# EAGLE design motherboard_v1_21 (EAGLE 7.5.0)
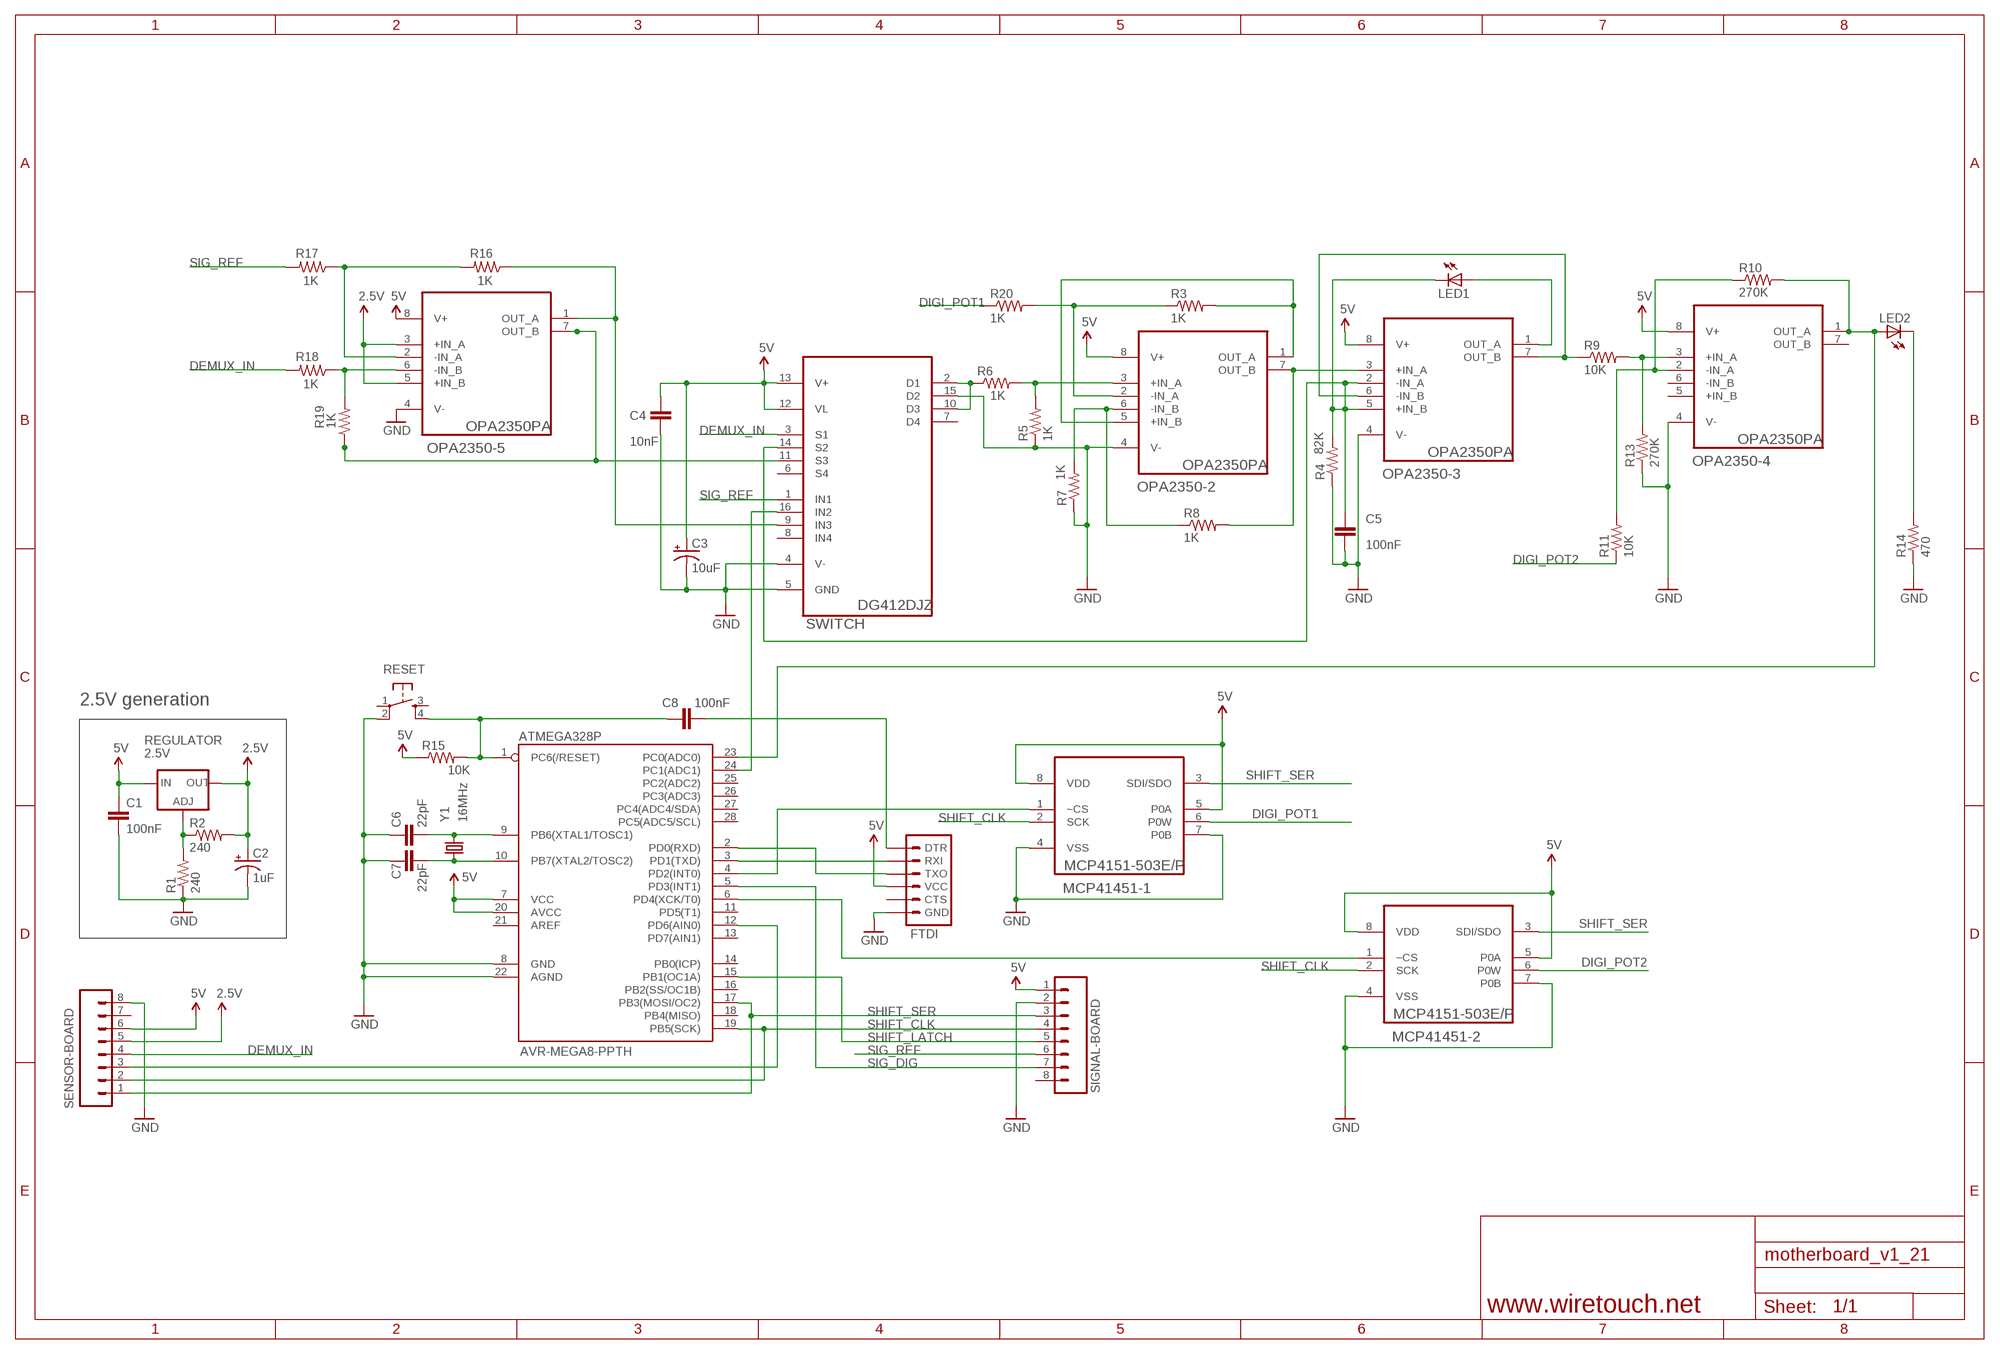
[diagram p0: schematic, sheet 1]

## Parts
ATMEGA328P  AVR-MEGA8-PPTH  [DIL28-3]
C1  100nF  CAPPTH  [CAP-PTH-SMALL]
C2  1uF  CAP_POLPTH2  [CPOL-RADIAL-10UF-25V]
C3  10uF  CAP_POLPTH2  [CPOL-RADIAL-10UF-25V]
C4  10nF  CAPPTH  [CAP-PTH-SMALL]
C5  100nF  CAPPTH  [CAP-PTH-SMALL]
C6  22pF  CAPPTH2  [CAP-PTH-SMALL2]
C7  22pF  CAPPTH2  [CAP-PTH-SMALL2]
C8  100nF  CAPPTH2  [CAP-PTH-SMALL2]
FTDI  ARDUINO_SERIAL_PROGRAMLONGPADS  [1X06_LONGPADS]
LED1  LED3MM  [LED3MM]
LED2  LED5MM  [LED5MM]
MCP41451-1  MCP4151-503E/P  [DIP254P762X533-8]
MCP41451-2  MCP4151-503E/P  [DIP254P762X533-8]
OPA2350-2  OPA2350PA  [DIP254P762X508-8]
OPA2350-3  OPA2350PA  [DIP254P762X508-8]
OPA2350-4  OPA2350PA  [DIP254P762X508-8]
OPA2350-5  OPA2350PA  [DIP254P762X508-8]
R1  240  RESISTORAXIAL-0.3  [AXIAL-0.3]
R2  240  RESISTORAXIAL-0.3  [AXIAL-0.3]
R3  1K  RESISTORAXIAL-0.3  [AXIAL-0.3]
R4  82K  RESISTORAXIAL-0.3  [AXIAL-0.3]
R5  1K  RESISTORAXIAL-0.3  [AXIAL-0.3]
R6  1K  RESISTORAXIAL-0.3  [AXIAL-0.3]
R7  1K  RESISTORAXIAL-0.3  [AXIAL-0.3]
R8  1K  RESISTORAXIAL-0.3  [AXIAL-0.3]
R9  10K  RESISTORAXIAL-0.3  [AXIAL-0.3]
R10  270K  RESISTORAXIAL-0.3  [AXIAL-0.3]
R11  10K  RESISTORAXIAL-0.3  [AXIAL-0.3]
R13  270K  RESISTORAXIAL-0.3  [AXIAL-0.3]
R14  470  RESISTORAXIAL-0.3  [AXIAL-0.3]
R15  10K  RESISTORAXIAL-0.3  [AXIAL-0.3]
R16  1K  RESISTORAXIAL-0.3  [AXIAL-0.3]
R17  1K  RESISTORAXIAL-0.3  [AXIAL-0.3]
R18  1K  RESISTORAXIAL-0.3  [AXIAL-0.3]
R19  1K  RESISTORAXIAL-0.3  [AXIAL-0.3]
R20  1K  RESISTORAXIAL-0.3  [AXIAL-0.3]
REGULATOR  2.5V  V_REG_317SINK  [TO220-ADJ]
RESET  TAC_SWITCHPTH  [TACTILE-PTH]
SENSOR-BOARD  M08LONGPADS  [1X08_LONGPADS]
SIGNAL-BOARD  M08LONGPADS  [1X08_LONGPADS]
SWITCH  DG412DJZ  [DIP254P762X533-16]
Y1  16MHz  CRYSTALHC49US  [HC49US]

## Nets
2.8V: C2.1(+) OPA2350-5.3(+IN_A) OPA2350-5.5(+IN_B) R2.P$2 REGULATOR.OUT SENSOR-BOARD.5 ; supply symbol labelled 2.5V
5V: ATMEGA328P.7(VCC) ATMEGA328P.20(AVCC) C1.1 C3.1(+) C4.1 FTDI.4(VCC) MCP41451-1.5(P0A) MCP41451-1.8(VDD) MCP41451-2.5(P0A) MCP41451-2.8(VDD) OPA2350-2.8(V+) OPA2350-3.8(V+) OPA2350-4.8(V+) OPA2350-5.8(V+) R15.P$1 REGULATOR.IN SENSOR-BOARD.6 SIGNAL-BOARD.1 SWITCH.12(VL) SWITCH.13(V+)
DEMUX_IN: R18.P$2 SENSOR-BOARD.4 SWITCH.3(S1)
DIGI_POT1: MCP41451-1.6(P0W) R20.P$1
DIGI_POT2: MCP41451-2.6(P0W) R11.P$1
GND: ATMEGA328P.8(GND) ATMEGA328P.22(AGND) C1.2 C2.2(-) C3.2(-) C4.2 C5.2 C6.1 C7.1 FTDI.6(GND) MCP41451-1.4(VSS) MCP41451-1.7(P0B) MCP41451-2.4(VSS) MCP41451-2.7(P0B) OPA2350-2.4(V-) OPA2350-3.4(V-) OPA2350-4.4(V-) OPA2350-5.4(V-) R1.P$1 R4.P$1 R5.P$1 R7.P$1 R13.P$1 R14.P$1 RESET.2 SENSOR-BOARD.8 SIGNAL-BOARD.2 SWITCH.4(V-) SWITCH.5(GND) SWITCH.15(D2)
N$1: R6.P$1 SWITCH.2(D1) SWITCH.10(D3)
N$2: OPA2350-2.1(OUT_A) OPA2350-2.5(+IN_B) R3.P$2
N$3: R1.P$2 R2.P$1 REGULATOR.ADJ
N$4: OPA2350-2.2(-IN_A) R3.P$1 R20.P$2
N$5: OPA2350-2.3(+IN_A) R5.P$2 R6.P$2
N$6: OPA2350-2.6(-IN_B) R7.P$2 R8.P$1
N$7: OPA2350-4.2(-IN_A) R10.P$1 R11.P$2
N$8: ATMEGA328P.24(PC1(ADC1)) SWITCH.16(IN2)
N$9: LED1.A OPA2350-3.1(OUT_A)
N$10: OPA2350-2.7(OUT_B) OPA2350-3.3(+IN_A) R8.P$2
N$11: C5.1 LED1.K(C) OPA2350-3.2(-IN_A) OPA2350-3.5(+IN_B) R4.P$2 SWITCH.14(S2)
N$12: OPA2350-3.6(-IN_B) OPA2350-3.7(OUT_B) R9.P$1
N$13: OPA2350-4.3(+IN_A) R9.P$2 R13.P$2
N$14: ATMEGA328P.23(PC0(ADC0)) LED2.A OPA2350-4.1(OUT_A) R10.P$2
N$15: ATMEGA328P.6(PD4(XCK/T0)) MCP41451-2.1(~CS)
N$16: OPA2350-5.6(-IN_B) R18.P$1 R19.P$2
N$17: LED2.K(C) R14.P$2
N$18: ATMEGA328P.9(PB6(XTAL1/TOSC1)) C6.2 Y1.2
N$19: ATMEGA328P.10(PB7(XTAL2/TOSC2)) C7.2 Y1.1
N$20: ATMEGA328P.1(PC6(/RESET)) C8.1 R15.P$2 RESET.4
N$21: ATMEGA328P.3(PD1(TXD)) FTDI.2(RXI)
N$22: ATMEGA328P.2(PD0(RXD)) FTDI.3(TXO)
N$23: C8.2 FTDI.1(DTR)
N$24: OPA2350-5.1(OUT_A) R16.P$1 SWITCH.9(IN3)
N$25: OPA2350-5.2(-IN_A) R16.P$2 R17.P$1
N$27: OPA2350-5.7(OUT_B) R19.P$1 SWITCH.11(S3)
N$28: ATMEGA328P.4(PD2(INT0)) MCP41451-1.1(~CS)
N$127: ATMEGA328P.12(PD6(AIN0)) SENSOR-BOARD.3
SHIFT_CLK: ATMEGA328P.19(PB5(SCK)) MCP41451-1.2(SCK) MCP41451-2.2(SCK) SENSOR-BOARD.2 SIGNAL-BOARD.4
SHIFT_LATCH: ATMEGA328P.15(PB1(OC1A)) SIGNAL-BOARD.5
SHIFT_SER: ATMEGA328P.17(PB3(MOSI/OC2)) MCP41451-1.3(SDI/SDO) MCP41451-2.3(SDI/SDO) SENSOR-BOARD.1 SIGNAL-BOARD.3
SIG_DIG: ATMEGA328P.5(PD3(INT1)) SIGNAL-BOARD.7
SIG_REF: R17.P$2 SIGNAL-BOARD.6 SWITCH.1(IN1)
Unconnected: ATMEGA328P.11(PD5(T1)) ATMEGA328P.13(PD7(AIN1)) ATMEGA328P.14(PB0(ICP)) ATMEGA328P.16(PB2(SS/OC1B)) ATMEGA328P.18(PB4(MISO)) ATMEGA328P.21(AREF) ATMEGA328P.25(PC2(ADC2)) ATMEGA328P.26(PC3(ADC3)) ATMEGA328P.27(PC4(ADC4/SDA)) ATMEGA328P.28(PC5(ADC5/SCL)) FTDI.5(CTS) OPA2350-4.5(+IN_B) OPA2350-4.6(-IN_B) OPA2350-4.7(OUT_B) RESET.1 RESET.3 SENSOR-BOARD.7 SIGNAL-BOARD.8 SWITCH.6(S4) SWITCH.7(D4) SWITCH.8(IN4)

## Notes on the sheet
- 2.5V generation
- www.wiretouch.net

## Library data of the parts
ATMEGA328P = SparkFun-DigitalIC:AVR-MEGA8-P: MICROCONTROLLER 8 Kbytes FLASH 1 kbytes SRAM 512 bytes EEPROM USART 4-channel 10 bit ADC 2-channel 8 bit ADC
C1 C4-C8 = SparkFun-Passives:CAP: Capacitor Standard 0603 ceramic capacitor, and 0.1" leaded capacitor.
C2 C3 = SparkFun-Passives:CAP_POL: Capacitor Polarized These are standard SMD and PTH capacitors. Normally 10uF, 47uF, and 100uF in electrolytic and tantalum varieties. Always verify the external diameter of the through hole cap, it varies with capacity, voltage, and manufacturer. The EIA devices should be standard.
FTDI = SparkFun-Connectors:ARDUINO_SERIAL_PROGRAM: FTDI connector footprints
LED1 LED2 = SparkFun-LED:LED: LEDs Standard schematic elements and footprints for 5mm, 3mm, 1206, and 0603 sized LEDs. 5mm - Spark Fun Electronics SKU : COM-00529 (and others)
MCP41451-1 MCP41451-2 = gkaindl:MCP4151-503E/P: Digital POT; MPN: MCP4151-503E/P; OC_FARNELL: 1840819; OC_NEWARK: 77M2694; PACKAGE: DIP-8; SUPPLIER: Microchip
OPA2350-2-OPA2350-5 = gkaindl:OPA2350PA: OPERATIONAL AMPLIFIER; MPN: OPA2350PA; OC_FARNELL: 4353316; OC_NEWARK: 75C4730; PACKAGE: PDIP; SUPPLIER: Texas Instruments
R1-R11 R13-R20 = SparkFun-Passives:RESISTOR: Resistor Basic schematic elements and footprints for 0603, 1206, and PTH resistors.
REGULATOR = SparkFun-PowerIC:V_REG_317: Voltage Regulator Standard LM317 adjustable voltage regulator. AOI (Adjust Output Input). Google 'LM317 Calculator' for easy to use app to get the two resistor values needed. 240/720 for 5V output. 240/390 for 3.3V output. Spark Fun Electronics SKU : COM-00527
RESET = SparkFun-Electromechanical:TAC_SWITCH: Momentary Switch Button commonly used for reset or general input. Spark Fun Electronics SKU : COM-00097 SMT- SWCH-08247
SENSOR-BOARD SIGNAL-BOARD = SparkFun-Connectors:M08: Header 8 Standard 8-pin 0.1" header. Use with straight break away headers (SKU : PRT-00116), right angle break away headers (PRT-00553), swiss pins (PRT-00743), machine pins (PRT-00117), and female headers (PRT-00115).
SWITCH = gkaindl:DG412DJZ: CMOS Analog switches; MPN: DG412DJZ; OC_FARNELL: 1561997; OC_NEWARK: 79K6183; PACKAGE: PDIP-16; SUPPLIER: INTERSIL
Y1 = SparkFun-FreqCtrl:CRYSTAL: Various standard crystals. Proven footprints. Spark Fun Electronics SKU : COM-00534

## Board
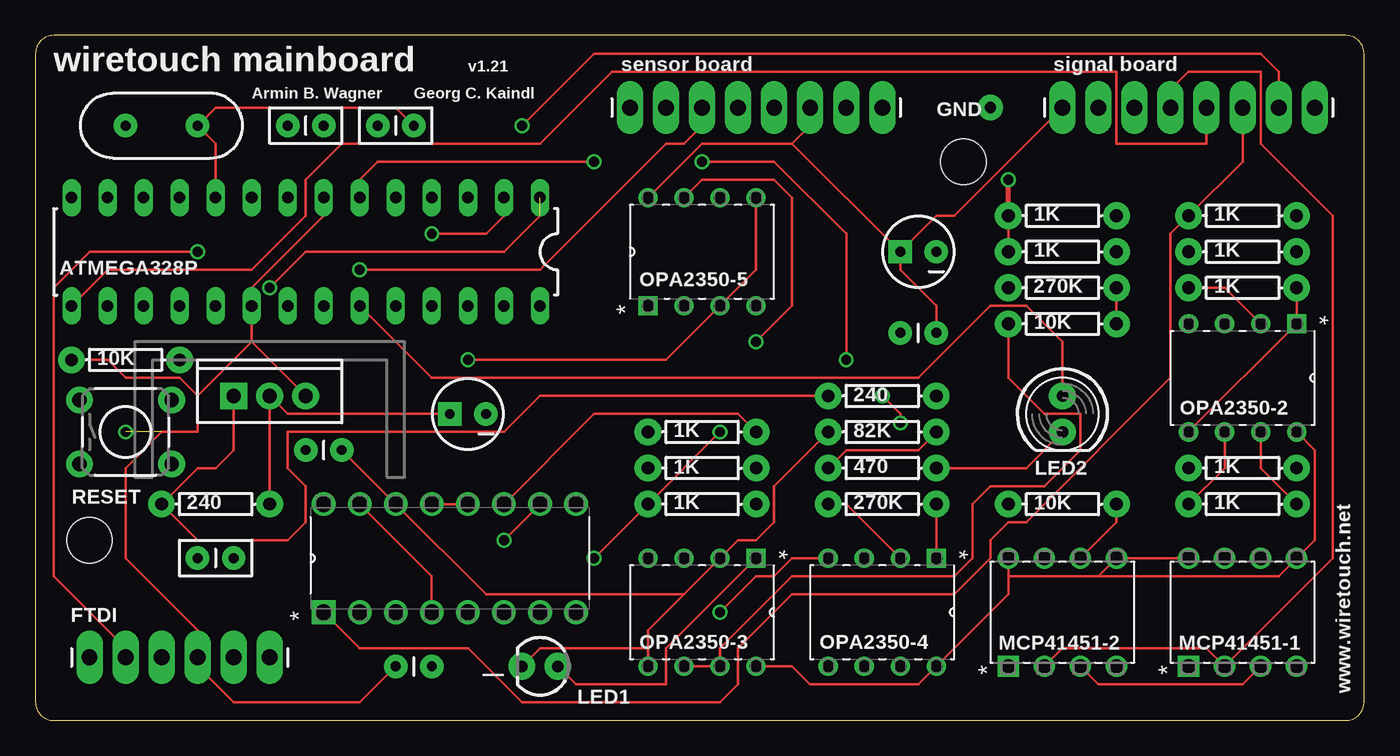
[diagram p1: board, top side]
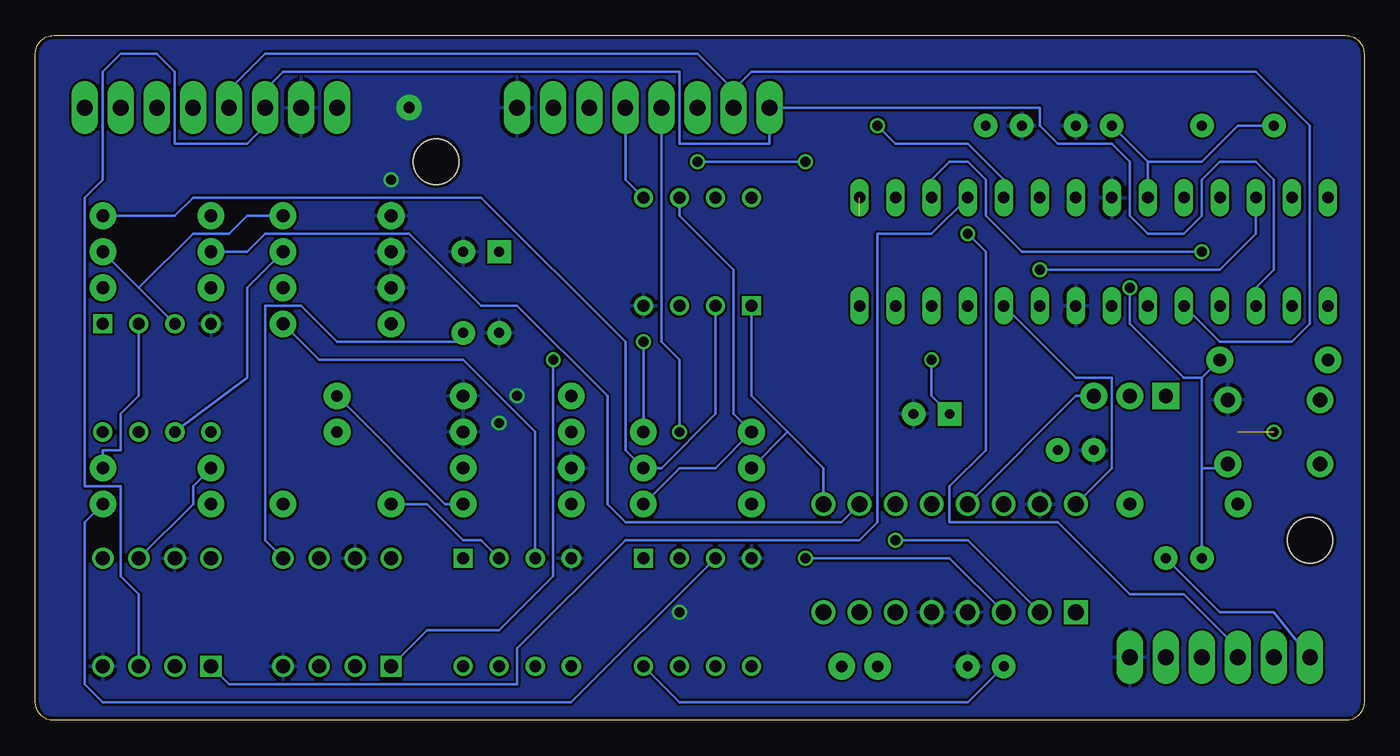
[diagram p2: board, bottom side, seen from below]

Size 93.65 x 48.26 mm. Coordinates in mm from the lower left corner, seen from the top.
Outline: 0,46.99 0,1.27 arc90 1.27,0 92.38,0 arc90 93.65,1.27 93.65,46.99 arc90 92.38,48.26 1.27,48.26 arc90 0,46.99
Copper layers (1*16): Top 0.035mm / dielectric 1.5mm / Bottom 0.035mm
Design rules "SeeedStudio_2layer_DRU_no_angle_20140221 *": minimum track width 6mil, minimum drill 12mil, track to track 6mil, track to pad 6mil, pad to pad 6mil, via to via 6mil, smd to smd 0mil, copper to edge 10mil, drill to drill 10mil, minimum pad ring 10mil, minimum via ring 6mil, stop-mask expansion 2mil, vias tented up to drill 100mil, thermal gap 10mil
Holes 3.2 mm at 3.81,12.7 65.41,39.37

### Footprints (pad centres in the part's own frame; a part is rotated, then mirrored left to right if it is on the bottom)
DIL28-3 = drill 0.813 long: 1 -16.51,-3.81; 2 -13.97,-3.81; 3 -11.43,-3.81; 4 -8.89,-3.81; 5 -6.35,-3.81; 6 -3.81,-3.81; 7 -1.27,-3.81; 8 1.27,-3.81; 9 3.81,-3.81; 10 6.35,-3.81; 11 8.89,-3.81; 12 11.43,-3.81; 13 13.97,-3.81; 14 16.51,-3.81; 15 16.51,3.81; 16 13.97,3.81; 17 11.43,3.81; 18 8.89,3.81; 19 6.35,3.81; 20 3.81,3.81; 21 1.27,3.81; 22 -1.27,3.81; 23 -3.81,3.81; 24 -6.35,3.81; 25 -8.89,3.81; 26 -11.43,3.81; 27 -13.97,3.81; 28 -16.51,3.81
CAP-PTH-SMALL = drill 0.7 pad 1.651: 1 0,0; 2 2.54,0
CPOL-RADIAL-10UF-25V = drill 0.7 pad 1.651 square: 1 1.27,0 | drill 0.7 pad 1.651: 2 -1.27,0
CAP-PTH-SMALL2 = drill 0.7 pad 1.651: 1 0,0; 2 2.54,0
1X06_LONGPADS = drill 1.118 pad 1.88 long: 1 0,0; 2 2.54,0; 3 5.08,0; 4 7.62,0; 5 10.16,0; 6 12.7,0
LED3MM = drill 0.813 pad 1.88: A -1.27,0; K 1.27,0
LED5MM = drill 0.813 pad 1.88: A -1.27,0; K 1.27,0
DIP254P762X533-8 = drill 0.991 square: 1 -7.62,7.62 | drill 0.991: 2 -7.62,5.08; 3 -7.62,2.54; 4 -7.62,0; 5 0,0; 6 0,2.54; 7 0,5.08; 8 0,7.62
DIP254P762X508-8 = drill 0.838 square: 1 -7.62,7.62 | drill 0.838: 2 -7.62,5.08; 3 -7.62,2.54; 4 -7.62,0; 5 0,0; 6 0,2.54; 7 0,5.08; 8 0,7.62
AXIAL-0.3 = drill 0.9 pad 1.88: P$1 -3.81,0; P$2 3.81,0
TO220-ADJ = drill 1 pad 1.88 square: ADJ -2.54,0 | drill 1 pad 1.88: IN 2.54,0; OUT 0,0
TACTILE-PTH = drill 1.016 pad 1.88: 1 -3.251,2.261; 2 3.251,2.261; 3 -3.251,-2.261; 4 3.251,-2.261
1X08_LONGPADS = drill 1.118 pad 1.88 long: 1 0,0; 2 2.54,0; 3 5.08,0; 4 7.62,0; 5 10.16,0; 6 12.7,0; 7 15.24,0; 8 17.78,0
DIP254P762X533-16 = drill 1.118 square: 1 -7.62,17.78 | drill 1.118: 2 -7.62,15.24; 3 -7.62,12.7; 4 -7.62,10.16; 5 -7.62,7.62; 6 -7.62,5.08; 7 -7.62,2.54; 8 -7.62,0; 9 0,0; 10 0,2.54; 11 0,5.08; 12 0,7.62; 13 0,10.16; 14 0,12.7; 15 0,15.24; 16 0,17.78
HC49US = drill 0.7 pad 1.651: 1 -2.54,0; 2 2.54,0

### Placement (x,y rotation side)
ATMEGA328P  19.05,33.02 180 top
C1  25.4,3.81 0 top
C2  30.48,21.59 180 top
C3  62.23,33.02 180 top
C4  63.5,27.3 180 top
C5  21.59,19.05 180 top
C6  20.32,41.91 180 top
C7  24.13,41.91 0 top
C8  11.43,11.43 0 top
FTDI  3.81,4.45 0 top
LED1  35.56,3.81 180 top
LED2  72.39,21.59 270 top
MCP41451-1  88.9,11.43 90 top
MCP41451-2  76.2,11.43 90 top
OPA2350-2  81.28,20.32 270 top
OPA2350-3  43.18,3.81 270 top
OPA2350-4  55.88,3.81 270 top
OPA2350-5  50.8,36.83 90 top
R1  59.69,22.86 180 top
R2  12.7,15.24 0 top
R3  85.09,30.48 0 top
R4  59.69,20.32 180 top
R5  72.39,35.56 0 top
R6  85.09,33.02 0 top
R7  72.39,33.02 0 top
R8  85.09,15.24 0 top
R9  72.39,27.94 0 top
R10  59.69,15.24 0 top
R11  72.39,15.24 180 top
R13  72.39,30.48 0 top
R14  59.69,17.78 0 top
R15  6.35,25.4 0 top
R16  46.99,17.78 0 top
R17  85.09,35.56 180 top
R18  46.99,15.24 180 top
R19  46.99,20.32 180 top
R20  85.09,17.78 0 top
REGULATOR  16.51,22.86 0 top
RESET  6.35,20.32 0 top
SENSOR-BOARD  41.91,43.18 0 top
SIGNAL-BOARD  72.39,43.18 0 top
SWITCH  38.1,15.24 90 top
Y1  8.89,41.91 180 top

### Tracks (layer width: path | path; a pad name or v marks a point on that pad's centre or on a via)
2.8V  (via drill 0.7)
  Top 0.178: C2.1 17.78,21.59 REGULATOR.OUT R2.P$2 | v30.48,25.4 44.45,25.4 OPA2350-5.3 50.8,31.75 OPA2350-5.5
  Bottom 0.178: SENSOR-BOARD.5 52.07,38.1 OPA2350-5.5 | v30.48,25.4 30.48,22.86 C2.1
5V  (via drill 0.7)  (1 unrouted)
  Top 0.178: SWITCH.12 SWITCH.13 | 15.24,26.67 ATMEGA328P.20 15.24,30.48 20.32,35.56 ATMEGA328P.7 | REGULATOR.IN 15.24,26.67 | OPA2350-5.8 46.99,40.64 53.34,40.64 | C3.1 53.34,40.64 | OPA2350-2.8 90.17,19.05 90.17,12.7 MCP41451-1.5 87.63,10.16 74.93,10.16 | MCP41451-1.8 MCP41451-2.5 74.93,10.16 | 68.58,10.16 68.58,8.89 OPA2350-4.8 62.23,2.54 54.61,2.54 53.34,3.81 OPA2350-3.8 | 68.58,10.16 MCP41451-2.8 | C1.1 22.86,1.27 13.97,1.27 11.43,3.81 FTDI.4 11.43,6.35 6.35,11.43 6.35,17.78 8.89,20.32 11.43,20.32 11.43,22.86 | 68.58,10.16 74.93,10.16 | 11.43,22.86 10.16,24.13 6.35,24.13 5.08,25.4 R15.P$1 | 15.24,26.67 11.43,22.86 | SENSOR-BOARD.6 54.61,41.91 53.34,40.64 | SIGNAL-BOARD.1 64.77,35.56 63.5,35.56 C3.1 | C4.1 63.5,29.21 60.96,31.75 C3.1
  Bottom 0.178: SWITCH.13 20.32,22.86 REGULATOR.IN | MCP41451-2.5 77.47,12.7 77.47,29.21 74.93,29.21 72.39,26.67 63.5,26.67 C4.1 | C1.1 27.94,1.27 48.26,1.27 OPA2350-3.8
  other vias: 6.35,20.32
DEMUX_IN  (via drill 0.7)
  Top 0.178: v39.37,11.43 R18.P$2 v48.26,20.32
  Bottom 0.178: SWITCH.3 29.21,11.43 v39.37,11.43 | v48.26,20.32 48.26,25.4 49.53,26.67 SENSOR-BOARD.4
DIGI_POT1
  Bottom 0.178: MCP41451-1.6 82.55,15.24 82.55,16.51 R20.P$1
DIGI_POT2
  Top 0.178: MCP41451-2.6 76.2,13.97 R11.P$1
GND  (via drill 0.7, 0.8 pad 1.78)
  Top 0.178: SWITCH.4 27.94,10.16 SWITCH.15 | R7.P$1 R5.P$1 | R14.P$1 57.15,19.05 62.23,19.05 R4.P$1 | v59.69,22.86 60.96,21.59 v60.96,20.95 | OPA2350-4.4 53.34,11.43 52.07,10.16 50.8,10.16 v48.26,7.62
  Top 0.356: R5.P$1 v68.58,38.1
  other vias: 67.31,43.18
  pour Bottom: 0,48.26 0,0 93.98,0 93.98,48.26
N$1  (via drill 0.7)
  Top 0.178: SWITCH.10 v33.02,12.7
  Bottom 0.178: SWITCH.2 27.94,12.7 v33.02,12.7 | R6.P$1 78.74,33.02 77.47,34.29 67.31,34.29 62.23,29.21 59.69,29.21 53.34,22.86 53.34,15.24 52.07,13.97 36.83,13.97 SWITCH.10
N$2
  Top 0.178: OPA2350-2.5 OPA2350-2.1 R3.P$2
N$3
  Top 0.178: REGULATOR.ADJ 13.97,19.05 12.7,17.78 11.43,17.78 R2.P$1 11.43,12.7 17.78,12.7 19.05,13.97 19.05,16.51 17.78,17.78 17.78,20.32 33.02,20.32 35.56,22.86 R1.P$2
N$4
  Top 0.178: OPA2350-2.2 83.82,30.48 R3.P$1
  Bottom 0.178: R20.P$2 88.9,19.05 87.63,19.05 87.63,21.59 86.36,22.86 OPA2350-2.2
N$5
  Bottom 0.178: R6.P$2 86.36,30.48 | 86.36,30.48 OPA2350-2.3 | R5.P$2 78.74,35.56 80.01,34.29 82.55,34.29 86.36,30.48
N$6
  Top 0.178: OPA2350-2.6 83.82,17.78 R8.P$1
  Bottom 0.178: R7.P$2 78.74,30.48 78.74,24.13 OPA2350-2.6
N$7
  Top 0.178: OPA2350-4.2 57.15,15.24 R10.P$1
  Bottom 0.178: R11.P$2 66.04,15.24 63.5,12.7 62.23,12.7 OPA2350-4.2
N$8
  Bottom 0.178: ATMEGA328P.24 20.32,24.13 17.78,24.13 17.78,17.78 SWITCH.16
N$9
  Top 0.178: OPA2350-3.1 44.45,5.08 44.45,2.54 38.1,2.54 LED1.A
N$10
  Top 0.178: OPA2350-2.7 86.36,17.78 R8.P$2
  Bottom 0.178: OPA2350-3.3 55.88,1.27 88.9,1.27 90.17,2.54 90.17,13.97 R8.P$2
N$11
  Top 0.178: C5.1 SWITCH.14 31.75,8.89 45.72,8.89 | 43.18,5.08 43.18,6.35 45.72,8.89 | 43.18,5.08 OPA2350-3.5 | 45.72,8.89 OPA2350-3.2 49.53,12.7 50.8,12.7 52.07,13.97 52.07,16.51 R4.P$2 | LED1.K 35.56,5.08 43.18,5.08
N$12
  Top 0.178: OPA2350-3.6 OPA2350-3.7 48.26,5.08 53.34,10.16 64.77,10.16 66.04,11.43 66.04,15.24 67.31,16.51 71.12,16.51 73.66,19.05 73.66,21.59 71.12,21.59 68.58,24.13 R9.P$1
N$13
  Top 0.178: R9.P$2 R13.P$2
  Bottom 0.178: OPA2350-4.3 58.42,20.32 63.5,25.4 73.66,25.4 R9.P$2
N$14
  Top 0.178: R10.P$2 OPA2350-4.1 | ATMEGA328P.23 27.94,24.13 62.23,24.13 67.31,29.21 69.85,29.21 72.39,26.67 LED2.A
  Bottom 0.178: LED2.A 64.77,15.24 R10.P$2
N$15  (via drill 0.7)
  Top 0.178: v57.15,25.4 57.15,34.29 52.07,39.37 v46.99,39.37 | ATMEGA328P.6 22.86,38.1 24.13,39.37 v39.37,39.37
  Bottom 0.178: v57.15,25.4 57.15,10.16 60.96,6.35 66.04,6.35 MCP41451-2.1 | v46.99,39.37 v39.37,39.37
N$16
  Bottom 0.178: OPA2350-5.6 48.26,35.56 44.45,31.75 44.45,21.59 R19.P$2 45.72,17.78 48.26,17.78 R18.P$1
N$17
  Top 0.178: R14.P$2 69.85,17.78 LED2.K
N$18
  Bottom 0.178: Y1.2 8.89,41.91 11.43,39.37 15.24,39.37 | 15.24,39.37 ATMEGA328P.9 | 15.24,39.37 C6.2
N$19
  Top 0.178: C7.2 25.4,43.18 12.7,43.18 Y1.1 12.7,40.64 ATMEGA328P.10
N$20  (via drill 0.7)  (1 unrouted)
  Top 0.178: v16.51,30.48 19.05,33.02 33.02,33.02 35.56,35.56
  Bottom 0.178: v16.51,30.48 16.51,27.94 12.7,24.13 11.43,24.13 | 11.43,24.13 11.43,17.78 | 11.43,17.78 C8.1 | 11.43,24.13 R15.P$2 | RESET.4 9.88,17.78 11.43,17.78
N$21  (via drill 0.7)
  Top 0.178: FTDI.2 6.35,5.08 1.27,10.16 1.27,30.48 3.81,33.02 v11.43,33.02
  Bottom 0.178: v11.43,33.02 24.13,33.02 26.67,35.56 26.67,38.1 27.94,39.37 29.21,39.37 30.48,38.1 ATMEGA328P.3
N$22  (via drill 0.7)
  Top 0.178: ATMEGA328P.2 33.02,35.56 31.75,34.29 v27.94,34.29
  Bottom 0.178: FTDI.3 8.89,5.08 12.7,8.89 16.51,8.89 21.59,13.97 29.21,13.97 29.21,16.51 26.67,19.05 26.67,33.02 v27.94,34.29
N$23
  Bottom 0.178: C8.2 10.16,7.62 6.35,7.62 FTDI.1
N$24
  Bottom 0.178: OPA2350-5.1 43.18,22.86 40.64,20.32 | 40.64,20.32 38.1,17.78 SWITCH.9 | 40.64,20.32 R16.P$1
N$25
  Bottom 0.178: R17.P$1 83.82,35.56 82.55,36.83 62.23,36.83 52.07,26.67 52.07,19.05 R16.P$2 49.53,17.78 45.72,21.59 OPA2350-5.2
N$27  (via drill 0.7)
  Top 0.178: SWITCH.11 39.37,21.59 49.53,21.59 R19.P$1 | OPA2350-5.7 46.99,38.1 52.07,38.1 53.34,36.83 53.34,29.21 v50.8,26.67
  Bottom 0.178: v50.8,26.67 R19.P$1
N$28
  Bottom 0.178: MCP41451-1.1 80.01,2.54 59.69,2.54 59.69,5.08 52.07,12.7 35.56,12.7 34.29,13.97 34.29,34.29 30.48,34.29 ATMEGA328P.4
N$127  (via drill 0.7)
  Top 0.178: SENSOR-BOARD.3 46.99,41.91 45.72,40.64 44.45,40.64 35.56,31.75 v22.86,31.75
  Bottom 0.178: ATMEGA328P.12 7.62,34.29 10.16,31.75 v22.86,31.75
SHIFT_CLK
  Top 0.178: MCP41451-2.2 72.39,5.08 82.55,5.08 MCP41451-1.2 91.44,11.43 91.44,35.56 86.36,40.64 86.36,45.72 81.28,45.72 80.01,44.45 SIGNAL-BOARD.4
  Bottom 0.178: SIGNAL-BOARD.4 80.01,44.45 77.47,46.99 46.99,46.99 44.45,44.45 | 44.45,44.45 SENSOR-BOARD.2 | ATMEGA328P.19 10.16,26.67 5.08,26.67 3.81,27.94 3.81,41.91 7.62,45.72 43.18,45.72 44.45,44.45
SHIFT_LATCH
  Top 0.178: SIGNAL-BOARD.5 82.55,40.64 76.2,40.64 76.2,45.72 40.64,45.72 35.56,40.64 21.59,40.64 19.05,38.1 19.05,35.56 15.24,31.75 5.08,31.75 ATMEGA328P.15
SHIFT_SER
  Top 0.178: MCP41451-2.3 74.93,2.54 85.09,2.54 MCP41451-1.3
  Bottom 0.178: MCP41451-1.3 86.36,8.89 87.63,10.16 87.63,16.51 90.17,16.51 90.17,36.83 88.9,38.1 88.9,45.72 87.63,46.99 85.09,46.99 83.82,45.72 83.82,40.64 78.74,40.64 77.47,41.91 SIGNAL-BOARD.3 77.47,44.45 76.2,45.72 48.26,45.72 48.26,40.64 41.91,40.64 SENSOR-BOARD.1 22.86,43.18 22.86,41.91 21.59,40.64 17.78,40.64 16.51,39.37 16.51,35.56 15.24,34.29 12.7,34.29 11.43,35.56 11.43,38.1 10.16,39.37 7.62,39.37 6.35,38.1 6.35,31.75 7.62,30.48 ATMEGA328P.17
SIG_DIG  (via drill 0.7)
  Top 0.178: SIGNAL-BOARD.7 87.63,45.72 86.36,46.99 39.37,46.99 v34.29,41.91
  Bottom 0.178: ATMEGA328P.5 25.4,38.1 27.94,40.64 33.02,40.64 v34.29,41.91
SIG_REF
  Top 0.178: SWITCH.1 22.86,5.08 30.48,5.08 34.29,1.27 48.26,1.27 49.53,2.54 49.53,5.08 53.34,8.89 64.77,8.89 67.31,11.43 67.31,12.7 68.58,13.97 69.85,13.97 80.01,24.13 80.01,34.29 R17.P$2 85.09,39.37 SIGNAL-BOARD.6

### Text on the board
tNames: wiretouch mainboard | v1.21 | sensor board | signal board | Armin B. Wagner | Georg C. Kaindl | GND | – | www.wiretouch.net
tValues: P1 | P1 | V-REG | GRN | BLK